# EAGLE schematic circuitsalad (EAGLE 7.5.0)
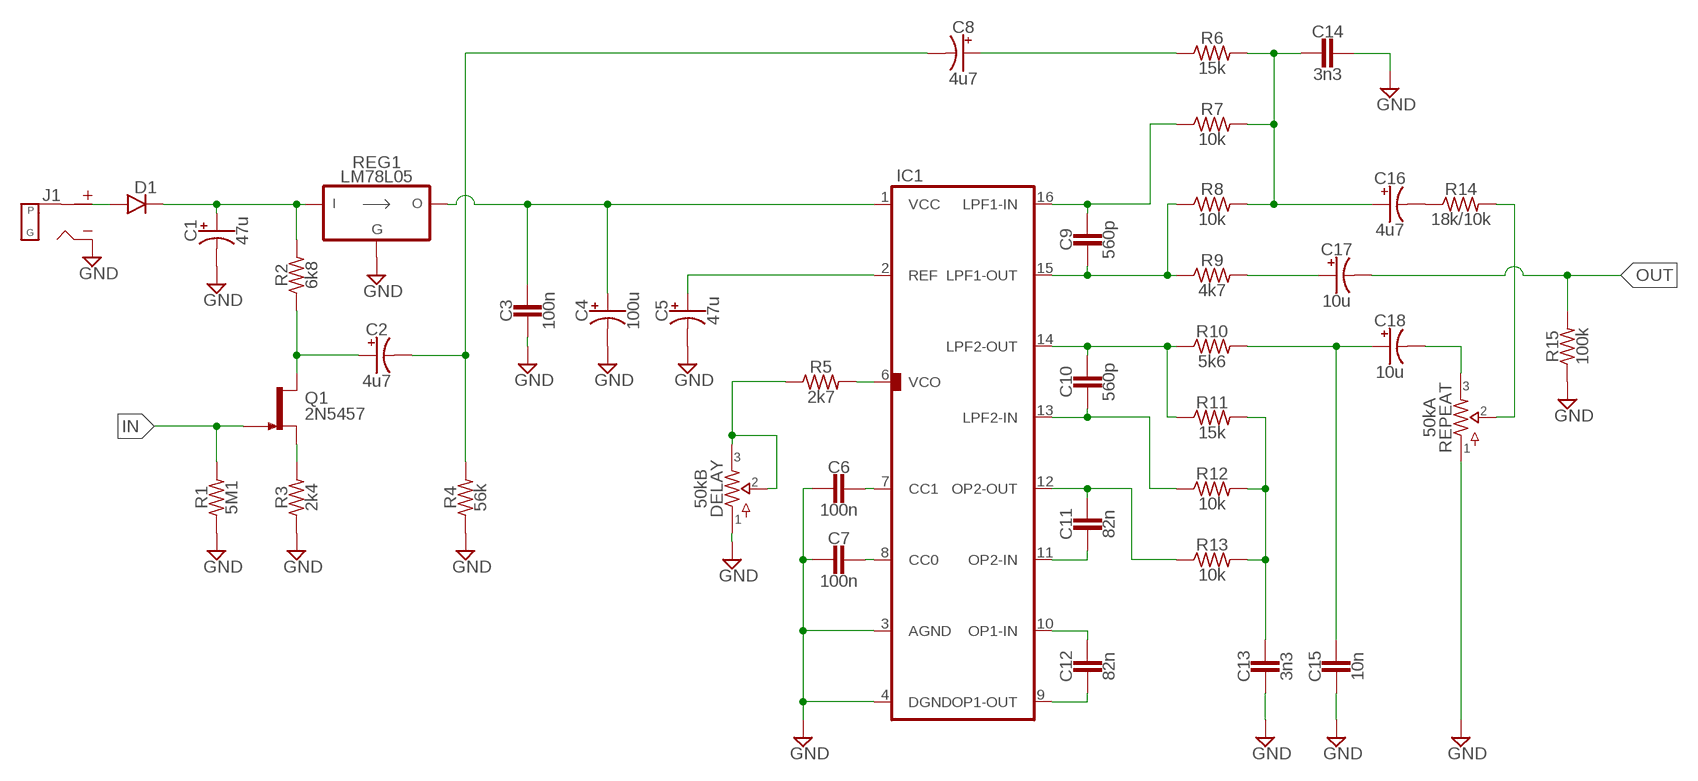
[diagram p0: schematic, sheet 1]

## Parts
C1  47u  0501  [050_020_1]
C2  4u7  0501  [050_020_1]
C3  100n  CER/FILM2  [050X030_025_2]
C4  100u  0501  [050_020_1]
C5  47u  0501  [050_020_1]
C6  100n  CER/FILM2  [050X030_025_2]
C7  100n  CER/FILM2  [050X030_025_2]
C8  4u7  0501  [050_020_1]
C9  560p  CER/FILM2  [050X030_025_2]
C10  560p  CER/FILM2  [050X030_025_2]
C11  82n  CER/FILM2  [050X030_025_2]
C12  82n  CER/FILM2  [050X030_025_2]
C13  3n3  CER/FILM2  [050X030_025_2]
C14  3n3  CER/FILM2  [050X030_025_2]
C15  10n  CER/FILM2  [050X030_025_2]
C16  4u7  0501  [050_020_1]
C17  10u  0501  [050_020_1]
C18  10u  0501  [050_020_1]
D1  DO41.3  [DO41-3]
DELAY  50kB  POTSSMALL_PADS  [PADS_SMALL]
IC1  PT2399TH  [DIL16]
J1  DC_MONO  [DC]
Q1  2N5457  [TO92-]
R1  5M1  R_.2  [R0207/2V]
R2  6k8  R_.2  [R0207/2V]
R3  2k4  R_.2  [R0207/2V]
R4  56k  R_.2  [R0207/2V]
R5  2k7  R_.2  [R0207/2V]
R6  15k  R_.2  [R0207/2V]
R7  10k  R_.2  [R0207/2V]
R8  10k  R_.2  [R0207/2V]
R9  4k7  R_.2  [R0207/2V]
R10  5k6  R_.2  [R0207/2V]
R11  15k  R_.2  [R0207/2V]
R12  10k  R_.2  [R0207/2V]
R13  10k  R_.2  [R0207/2V]
R14  18k/10k  R_.2  [R0207/2V]
R15  100k  R_.2  [R0207/2V]
REG1  LM78L05  [TO92-]
REPEAT  50kA  POTSSMALL_PADS  [PADS_SMALL]

## Nets
GND: C1.- C3.2 C4.- C5.- C6.2 C7.2 C13.2 C14.1 C15.2 DELAY.1 IC1.3(AGND) IC1.4(DGND) J1.S(SLEEVE) R1.1 R3.1 R4.1 R15.1 REG1.2(GND) REPEAT.1
IN: Q1.1(G) R1.2
N$1: D1.A J1.T(TIP)
N$2: C1.+ D1.C R2.2 REG1.1(VI)
N$3: C2.+ Q1.3(D) R2.1
N$4: Q1.2(S) R3.2
N$6: C6.1 IC1.7(CC1)
N$7: C7.1 IC1.8(CC0)
N$8: DELAY.2 DELAY.3 R5.1
N$9: IC1.6(VCO) R5.2
N$10: C3.1 C4.+ IC1.1(VCC) REG1.3(VO)
N$11: C2.- C8.- R4.2
N$12: C12.1 IC1.10(OP1-IN)
N$13: C12.2 IC1.9(OP1-OUT)
N$14: C11.2 IC1.11(OP2-IN)
N$15: C11.1 IC1.12(OP2-OUT) R13.1
N$16: C10.2 IC1.13(LPF2-IN) R12.1
N$17: C10.1 IC1.14(LPF2-OUT) R10.1 R11.1
N$18: C9.1 IC1.16(LPF1-IN) R7.1
N$19: C9.2 IC1.15(LPF1-OUT) R8.1 R9.1
N$20: C5.+ IC1.2(REF)
N$21: C13.1 R11.2 R12.2 R13.2
N$23: C17.+ R9.2
N$24: C8.+ R6.1
N$25: C15.1 C18.+ R10.2
N$26: C14.2 C16.+ R6.2 R7.2 R8.2
N$27: C16.- R14.1
N$28: C18.- REPEAT.3
N$30: R14.2 REPEAT.2
OUT: C17.- R15.2

## Library data of the parts
C1 C2 C4 C5 C8 C16-C18 = capacitors-elec:050: 0.22 - 100uF Xicon values at Mouser.com: 10V: 10 - 100uF; 16V: 2.2 - 47uF; 25V: 0.47 - 47uF; 50V: 0.22 - 22uF
C3 C6 C7 C9-C15 = capacitors-film:CER/FILM: 47 - 120pF Xicon Ceramic Disc 2.5mm lead spacing
D1 = diodes:DO41: DO-41 Package Diodes: 1N4001 - 1N40019 Zener Diodes: 1N4728 - 1N4764
DELAY REPEAT = potentiometers:POTS
IC1 = integrated circuits:PT2399: Echo Processor IC
J1 = jacks:DC_MONO
Q1 = transistors:2N5457: N-CHANNEL JFET
R1-R15 = resistors:R_
REG1 = regulators:LM78L05